# EAGLE design usb-isolator (EAGLE 6.6.0)
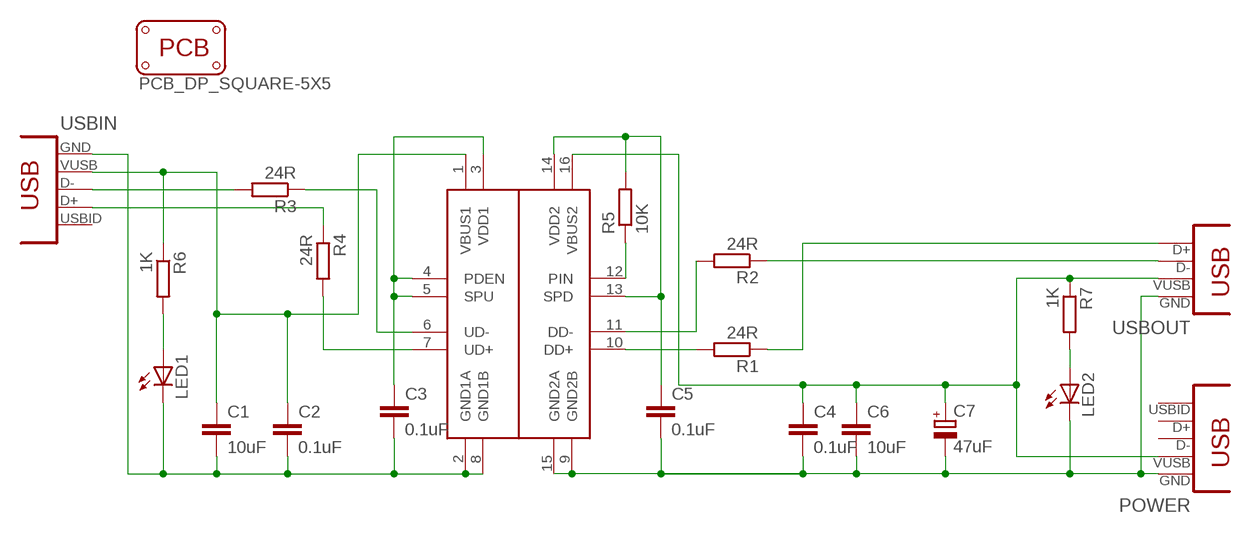
[diagram p0: schematic, sheet 1]

## Parts
C1  10uF  C-EUC0805K  [C0805K]
C2  0.1uF  C-EUC0805K  [C0805K]
C3  0.1uF  C-EUC0805K  [C0805K]
C4  0.1uF  C-EUC0805K  [C0805K]
C5  0.1uF  C-EUC0805K  [C0805K]
C6  10uF  C-EUC0805K  [C0805K]
C7  47uF  CPOL-EUD/7343-31W  [D/7343-31W]
IC1  ADUM3160BRWZ  [SO16W]
LED1  LED-0805  [LED-805]
LED2  LED-0805  [LED-805]
POWER  CON-USB-F-MINI-B  [CONN_USB_MINI-B]
R1  24R  R-EU_M0805  [M0805]
R2  24R  R-EU_M0805  [M0805]
R3  24R  R-EU_M0805  [M0805]
R4  24R  R-EU_M0805  [M0805]
R5  10K  R-EU_M0805  [M0805]
R6  1K  R-EU_M0805  [M0805]
R7  1K  R-EU_M0805  [M0805]
USB-ISOLATOR  PCB_DP_SQUARE-5X5  [DP5050_V1]
USBIN  CON-USB-F-MINI-B  [CONN_USB_MINI-B]
USBOUT  CON-USB-F-2PB  [CONN_USB_A_F]

## Nets
GND1: C1.2 C2.2 C3.2 IC1.2(GND1A) IC1.8(GND1B) LED1.C USBIN.GND
GND2: C4.2 C5.2 C6.2 C7.- IC1.9(GND2B) IC1.15(GND2A) LED2.C POWER.GND USBOUT.4(GND)
N$1: R3.2 USBIN.D-
N$2: IC1.6(UD-) R3.1
N$3: R1.1 USBOUT.3(D+)
N$4: IC1.11(DD-) R2.2
N$5: IC1.10(DD+) R1.2
N$6: IC1.12(PIN) R5.1
N$7: R4.1 USBIN.D+
N$8: R2.1 USBOUT.2(D-)
N$9: IC1.7(UD+) R4.2
N$10: C5.1 IC1.13(SPD) IC1.14(VDD2) R5.2
N$11: C3.1 IC1.3(VDD1) IC1.4(PDEN) IC1.5(SPU)
N$12: LED1.A R6.2
N$13: LED2.A R7.2
VBUS1: C1.1 C2.1 IC1.1(VBUS1) R6.1 USBIN.VUSB
VBUS2: C4.1 C6.1 C7.+ IC1.16(VBUS2) POWER.VUSB R7.1 USBOUT.1(VUSB)
Unconnected: POWER.BODY@1(BODY) POWER.BODY@2(BODY) POWER.BODY@3(BODY) POWER.BODY@4(BODY) POWER.D+ POWER.D- POWER.ID(USBID) USBIN.BODY@1(BODY) USBIN.BODY@2(BODY) USBIN.BODY@3(BODY) USBIN.BODY@4(BODY) USBIN.ID(USBID) USBOUT.B1(BODY) USBOUT.B2(BODY)

## Library data of the parts
C1-C6 = rcl:C-EU: CAPACITOR, European symbol
C7 = rcl:CPOL-EU: POLARIZED CAPACITOR, European symbol
IC1 = semiconductors:ADUM3160
LED1 LED2 = semiconductors:LED: Light Emitting Diode
POWER USBIN = dp_devices:CON-USB-F: USB Female connector
R1-R7 = resistor:R-EU_: RESISTOR, European symbol
USB-ISOLATOR = mechanical:PCB_DP_SQUARE: Dangerous Prototypes Standard Square PCB sizes (5050 is 49.9x49.9 for panelisation)
USBOUT = mechanical:CON-USB-F-2PB: USB Female connector with 2 body pins

## Board
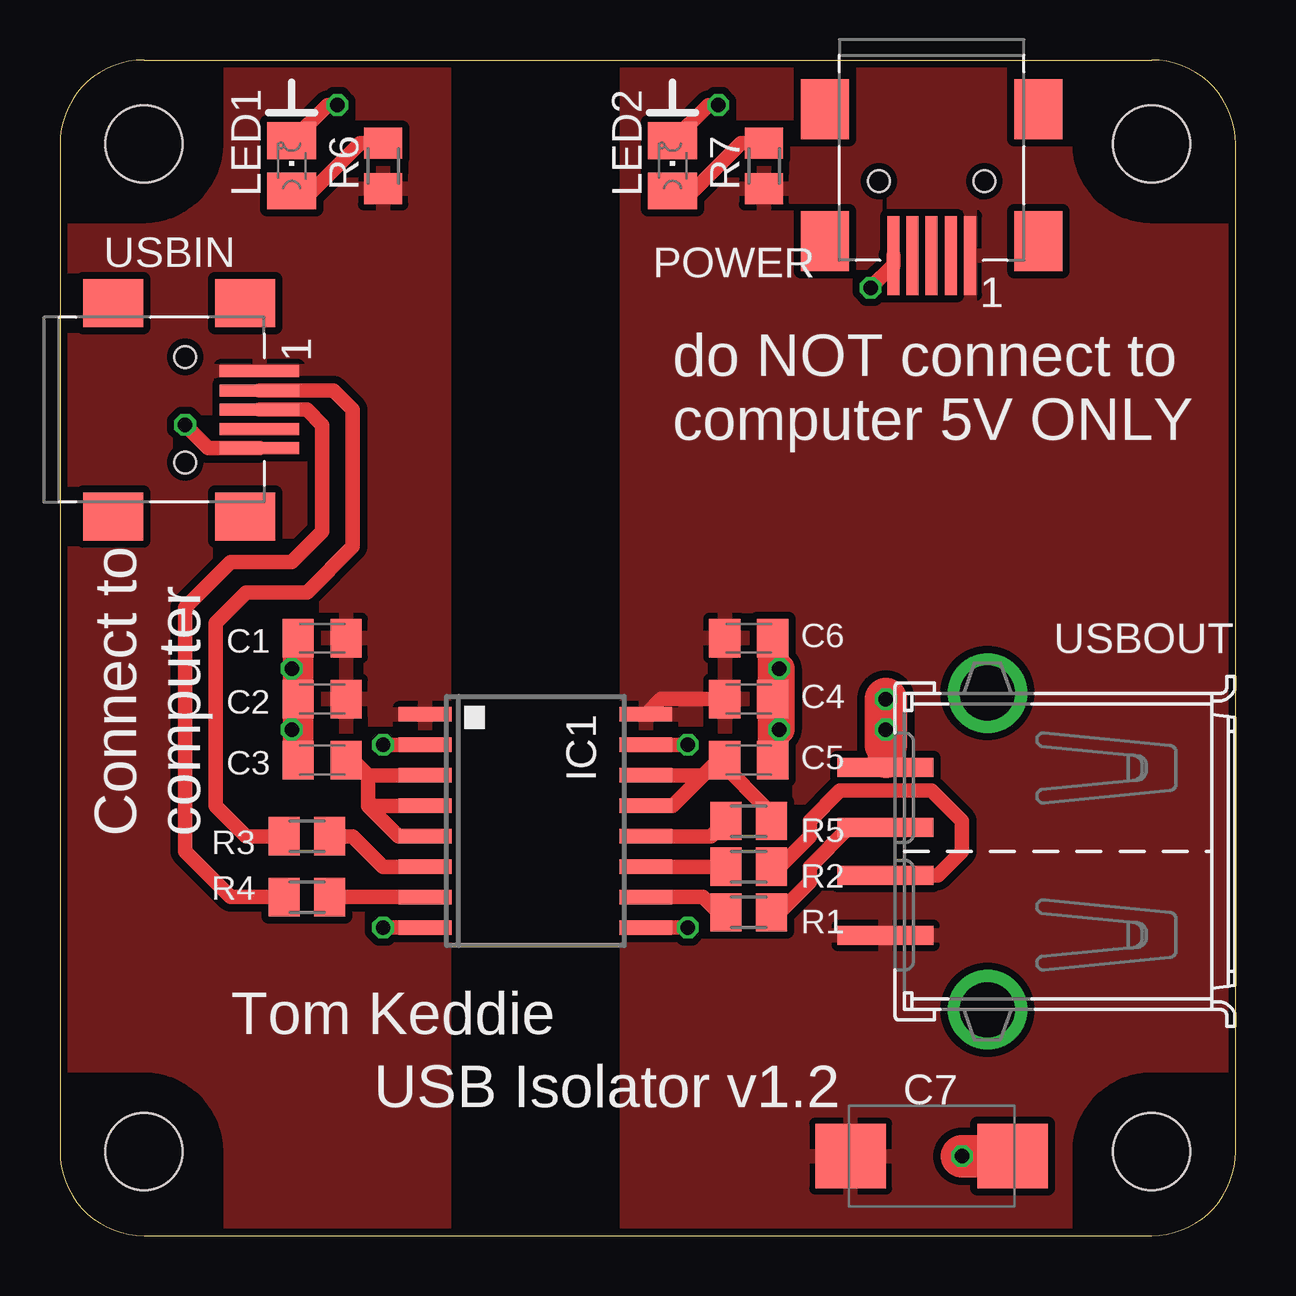
[diagram p1: board, top side]
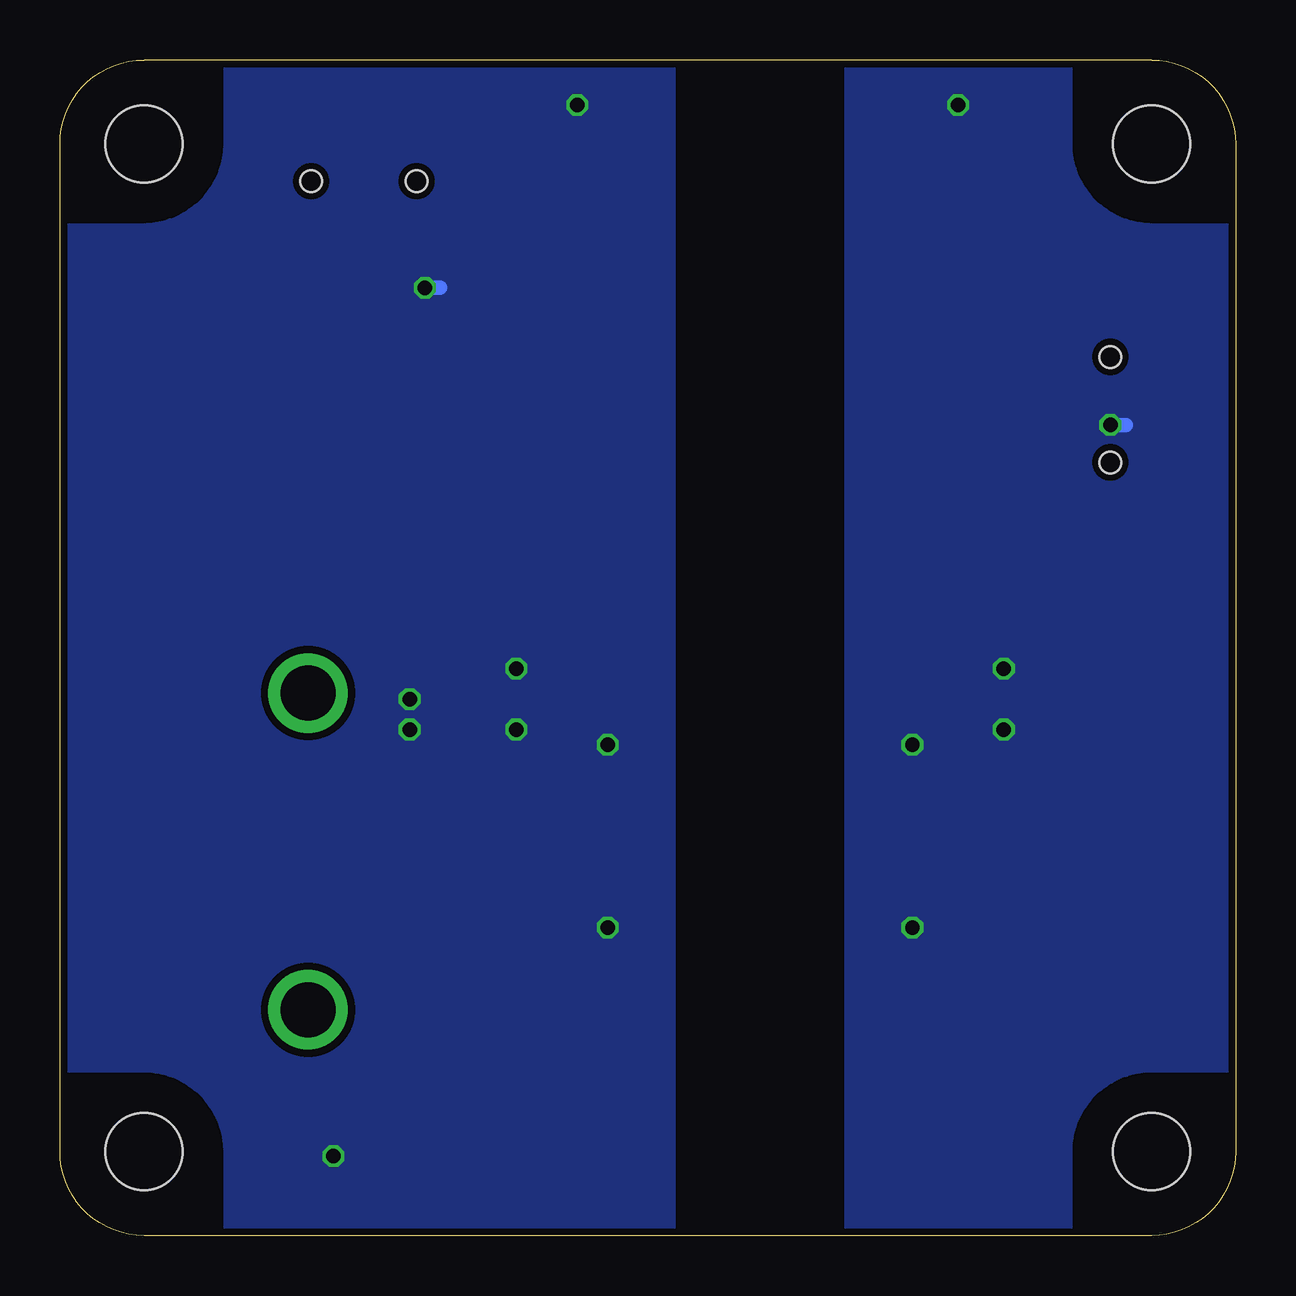
[diagram p2: board, bottom side, seen from below]

Size 49 x 49 mm. Coordinates in mm from the lower left corner, seen from the top.
Copper layers (1*16): Top 0.035mm / dielectric 1.5mm / Bottom 0.035mm
Design rules "ITEADstudio_DRC": minimum track width 6mil, minimum drill 12mil, track to track 6mil, track to pad 6mil, pad to pad 6mil, via to via 6mil, smd to smd 0mil, copper to edge 10mil, drill to drill 10mil, minimum pad ring 10mil, minimum via ring 6mil, stop-mask expansion 2mil, vias tented up to drill 100mil, thermal gap 10mil

### Footprints (pad centres in the part's own frame; a part is rotated, then mirrored left to right if it is on the bottom)
C0805K = smd 1.3 x 1.6: 1 -1,0; 2 1,0
D/7343-31W = smd 2.95 x 2.7: + 3.375,0; - -3.375,0
SO16W = smd 0.6 x 2.2: 1 -4.445,-4.6; 2 -3.175,-4.6; 3 -1.905,-4.6; 4 -0.635,-4.6; 5 0.635,-4.6; 6 1.905,-4.6; 7 3.175,-4.6; 8 4.445,-4.6; 9 4.445,4.6; 10 3.175,4.6; 11 1.905,4.6; 12 0.635,4.6; 13 -0.635,4.6; 14 -1.905,4.6; 15 -3.175,4.6; 16 -4.445,4.6
LED-805 = smd 2.032 x 1.524: A 0,-1.05; C 0,1.05
CONN_USB_MINI-B = smd 2 x 2.5: BODY@1 -4.45,2.5; BODY@2 4.45,2.5; BODY@3 4.45,-3; BODY@4 -4.45,-3 | smd 0.5 x 3.3: D+ 0,3.1; D- -0.8,3.1; GND 1.6,3.1; ID 0.8,3.1; VUSB -1.6,3.1 | hole 0.9: -2.2,0; 2.2,0
M0805 = smd 1.3 x 1.6: 1 -0.95,0; 2 0.95,0
DP5050_V1 = hole 3.2: 4,4; 46,4; 46,46; 4,46
CONN_USB_A_F = smd 0.8 x 4: 1 -3.5,7; 2 -1,7; 3 1,7; 4 3.5,7 | drill 2.3: B1 -6.6,2.75; B2 6.6,2.75

### Placement (x,y rotation side)
C1  10.93,24.9 180 top
C2  10.93,22.36 180 top
C3  10.93,19.82 180 top
C4  28.71,22.36 0 top
C5  28.71,19.82 0 top
C6  28.71,24.9 0 top
C7  36.33,3.31 180 top
IC1  19.82,17.28 270 top
LED1  9.66,44.59 0 top
LED2  25.54,44.59 0 top
POWER  36.33,43.95 180 top
R1  28.71,13.47 180 top
R2  28.71,15.38 180 top
R3  10.29,16.64 180 top
R4  10.29,14.11 0 top
R5  28.71,17.28 0 top
R6  13.47,44.59 90 top
R7  29.34,44.59 90 top
U$1  [VHS-LOGO-SMALL]  24.27,23.63 90 top
USB-ISOLATOR  -0.5,-0.5 0 top
USBIN  5.21,34.42 270 top
USBOUT  41.41,16.01 90 top

### Tracks (layer width: path | path; a pad name or v marks a point on that pad's centre or on a via)
GND1  (via drill 0.6)
  Top 0.305: v9.66,21.09 9.93,21.09 9.93,21.73
  Top 0.61: IC1.8 v13.47,12.84 | IC1.2 v13.47,20.45 | USBIN.GND 6.18,32.83 v5.21,33.79 | LED1.C 11.15,47.12 v11.56,47.12
  Top 1.27: C3.2 9.93,21.73 C2.2 C1.2
  Bottom 0.61: v5.21,33.79 4.58,33.79
  other vias: 9.66,23.63
  pour Bottom (isolate 0.305): -0.4,49.4 -0.4,-0.4 16.01,-0.4 16.01,49.4
GND2  (via drill 0.6)
  Top 0.61: POWER.GND 34.73,40.45 v33.79,39.51 | IC1.15 v26.17,20.45 | IC1.9 v26.17,12.84 | LED2.C 27.02,47.12 v27.44,47.12
  Top 0.813: USBOUT.4 34.42,19.82
  Top 1.27: C5.2 29.71,21.09 | 29.71,21.09 C4.2 C6.2 | v29.98,23.63 v29.98,21.09 29.71,21.09
  Top 1.524: 34.42,19.82 34.42,20.45
  Top 1.778: C7.- v37.6,3.31 | 34.42,20.45 v34.42,22.36
  Bottom 0.61: v33.79,39.51 33.16,39.51
  other vias: 34.42,21.09
  pour Bottom (isolate 0.305): 23.63,-1.14 49.66,-1.14 49.66,49.4 23.63,49.4
N$1
  Top 0.61: R3.2 7.76,16.64 6.49,17.91 6.49,25.54 7.76,26.8 10.29,26.8 12.2,28.71 12.2,34.42 11.4,35.23 USBIN.D-
N$2
  Top 0.61: IC1.6 13.47,15.38 12.2,16.64 R3.1
N$3
  Top 0.61: R1.1 29.98,13.47 31.25,14.74 31.25,15.38 32.88,17.01 USBOUT.3
N$4
  Top 0.61: IC1.11 R2.2
N$5
  Top 0.61: IC1.10 26.8,14.11 27.44,13.47 R1.2
N$6
  Top 0.61: IC1.12 27.12,16.64 R5.1
N$7
  Top 0.61: R4.1 7.12,14.11 5.21,16.01 5.21,26.17 7.12,28.07 9.66,28.07 10.93,29.34 10.93,33.79 10.29,34.42 USBIN.D+
N$8
  Top 0.61: USBOUT.2 36.6,15.01 37.6,16.01 37.6,17.28 36.33,18.55 32.52,18.55 31.25,17.28 31.25,16.64 29.98,15.38 R2.1
N$9
  Top 0.61: IC1.7 R4.2
N$10
  Top 0.61: IC1.13 25.54,17.91 26.8,19.18 | 26.8,19.18 27.44,19.82 C5.1 27.71,19.55 29.34,17.91 29.34,17.59 R5.2 | IC1.14 26.8,19.18
N$11
  Top 0.61: IC1.5 14.11,16.64 12.84,17.91 | 12.84,17.91 12.84,19.18 | 12.84,19.18 12.2,19.82 C3.1 | IC1.3 12.84,19.18 | IC1.4 12.84,17.91
N$12
  Top 0.61: LED1.A 10.52,43.53 12.52,45.53 R6.2
N$13
  Top 0.61: LED2.A 26.39,43.53 28.39,45.53 R7.2
VBUS1
  pour Top (isolate 0.305): -0.4,49.4 16.01,49.4 16.01,-0.4 -0.4,-0.4
VBUS2
  Top 0.61: IC1.16 25.05,22.36 C4.1
  pour Top (isolate 0.305): 49.66,49.4 49.66,-0.5 23.63,-0.5 23.63,49.4

### Text on the board
tPlace: .
tNames: do NOT connect to / computer 5V ONLY | Connect to / computer | Tom Keddie | USB Isolator v1.2